# Altium project PCB_Project.PrjPcb
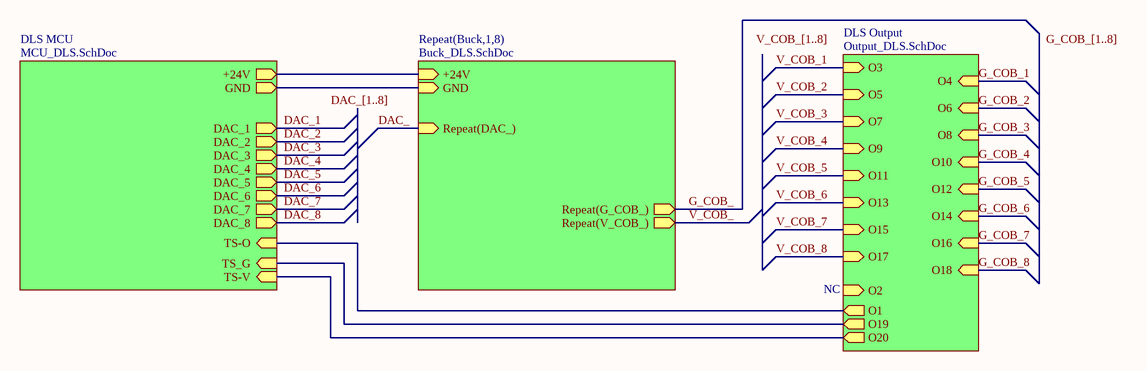
[diagram p0: Main_DLS.SchDoc]
4 sheets, 164 parts. Net scope: hierarchical (ports join the sheet entries above them; power ports are global).
Board file: MainPCB.PcbDoc
Sheets:
  Main_DLS.SchDoc
    DLS MCU = MCU_DLS.SchDoc
    Buck1 = Buck_DLS.SchDoc
    Buck2 = Buck_DLS.SchDoc
    Buck3 = Buck_DLS.SchDoc
    Buck4 = Buck_DLS.SchDoc
    Buck5 = Buck_DLS.SchDoc
    Buck6 = Buck_DLS.SchDoc
    Buck7 = Buck_DLS.SchDoc
    Buck8 = Buck_DLS.SchDoc
    DLS Output = Output_DLS.SchDoc

## Sheet Main_DLS.SchDoc: DLS Main Board
size 254 x 177 mm; Author: hdiushdaisd; DrawnBy: Artur Bereit; Revision: 1.1; SheetNumber: 1; SheetTotal: 4; SPICEModelCacheWKBDPPFP: <root> / <DocumentId>WKBDPPFP</DocumentId> / </root>

### Sub-sheets
DLS MCU = MCU_DLS.SchDoc: DAC_1 (out), DAC_2 (out), DAC_3 (out), DAC_4 (out), DAC_5 (out), DAC_6 (out), DAC_7 (out), DAC_8 (out), TS-O (in), TS_G (in), TS-V (in), +24V (out), GND (out)
DLS Output = Output_DLS.SchDoc: O1 (out), O2 (in), O3 (in), O4 (in), O5 (in), O6 (in), O7 (in), O8 (in), O9 (in), O10 (in), O11 (in), O12 (in), O13 (in), O14 (in), O15 (in), O16 (in), O17 (in), O18 (in), O19 (out), O20 (out)
Repeat(Buck,1,8) = Buck_DLS.SchDoc: Repeat(DAC_) (in), Repeat(G_COB_) (out), Repeat(V_COB_) (out), GND (in), +24V (in)

### Nets
+3.3V: sheet DLS MCU/TS-V, sheet DLS Output/O20
GND: sheet DLS MCU/TS_G, sheet DLS MCU/GND, sheet Repeat(Buck,1,8)/GND, sheet DLS Output/O19
V_COB_1: sheet DLS MCU/+24V, sheet Repeat(Buck,1,8)/+24V, sheet DLS Output/O3, sheet DLS Output/O5, sheet DLS Output/O7, sheet DLS Output/O9, sheet DLS Output/O11, sheet DLS Output/O13, sheet DLS Output/O15, sheet DLS Output/O17  [also labelled V_COB_2, V_COB_3, V_COB_4, V_COB_5, V_COB_6, V_COB_7, V_COB_8]
DAC_: sheet Repeat(Buck,1,8)/Repeat(DAC_)
G_COB_: sheet Repeat(Buck,1,8)/Repeat(G_COB_)
IO1: sheet DLS MCU/TS-O, sheet DLS Output/O1
V_COB_: sheet Repeat(Buck,1,8)/Repeat(V_COB_)

### Buses and harness runs
bus DAC_[1..8]
bus G_COB_[1..8]
bus V_COB_[1..8]

### Notes on the sheet
- NC
- Labels drawn without touching a wire or pin: DAC_[1..8], G_COB_[1..8], V_COB_[1..8]

## Sheet MCU_DLS.SchDoc: DLS MCU
size A3; DrawnBy: Artur Bereit; Revision: 1.0; SheetNumber: 3; SheetTotal: 4; SPICEModelCacheRWZWSWZR: <root> / <DocumentId>RWZWSWZR</DocumentId> / <CacheFrame Number="0"> / <Model Name="0805_150080gs75000" Kind="CKT"> / <Text>****** / .subckt 0805_150080GS75000  1  2 / D1 1 2 SMCW / .MODEL SMCW D / + IS=906.98E-12 / + N=4.4982 / + RS=1.5743 / + IKF=518.93E-9 / + CJO=1.0000E-12 / + M=.3333 / + VJ=.75 / + BV=5 / + IBV=10.00E-6 / + TT=5.0000E-9 / .ends</Text> / </Model> / <Model Name="0805_150080as75000" Kind="CKT"> / <Text>****** / .subckt 0805_150080AS75000  1  2 / D1 1 2 SMCW / .MODEL SMCW D / + IS=10.010E-21 / + N=1.8643 / + RS=1.0000E-6 / + IKF=999 / + CJO=1.0000E-12 / + M=.3333 / + VJ=.75 / + BV=5 / + IBV=10.00E-6 / + TT=5.0000E-9 / .ends</Text> / </Model> / <Model Name="860020672011_22uf" Kind="CKT"> / <Text>******* / .subckt 860020672011_22uF 1 2 / Rser 1 3 0.725557254649 / Lser 2 4 4.139560626E-09 / C1 3 4 0.000022 / Rpar 3 4 4545454.54545455 / .ends 860020672011_22uF</Text> / </Model> / </CacheFrame> / </root>
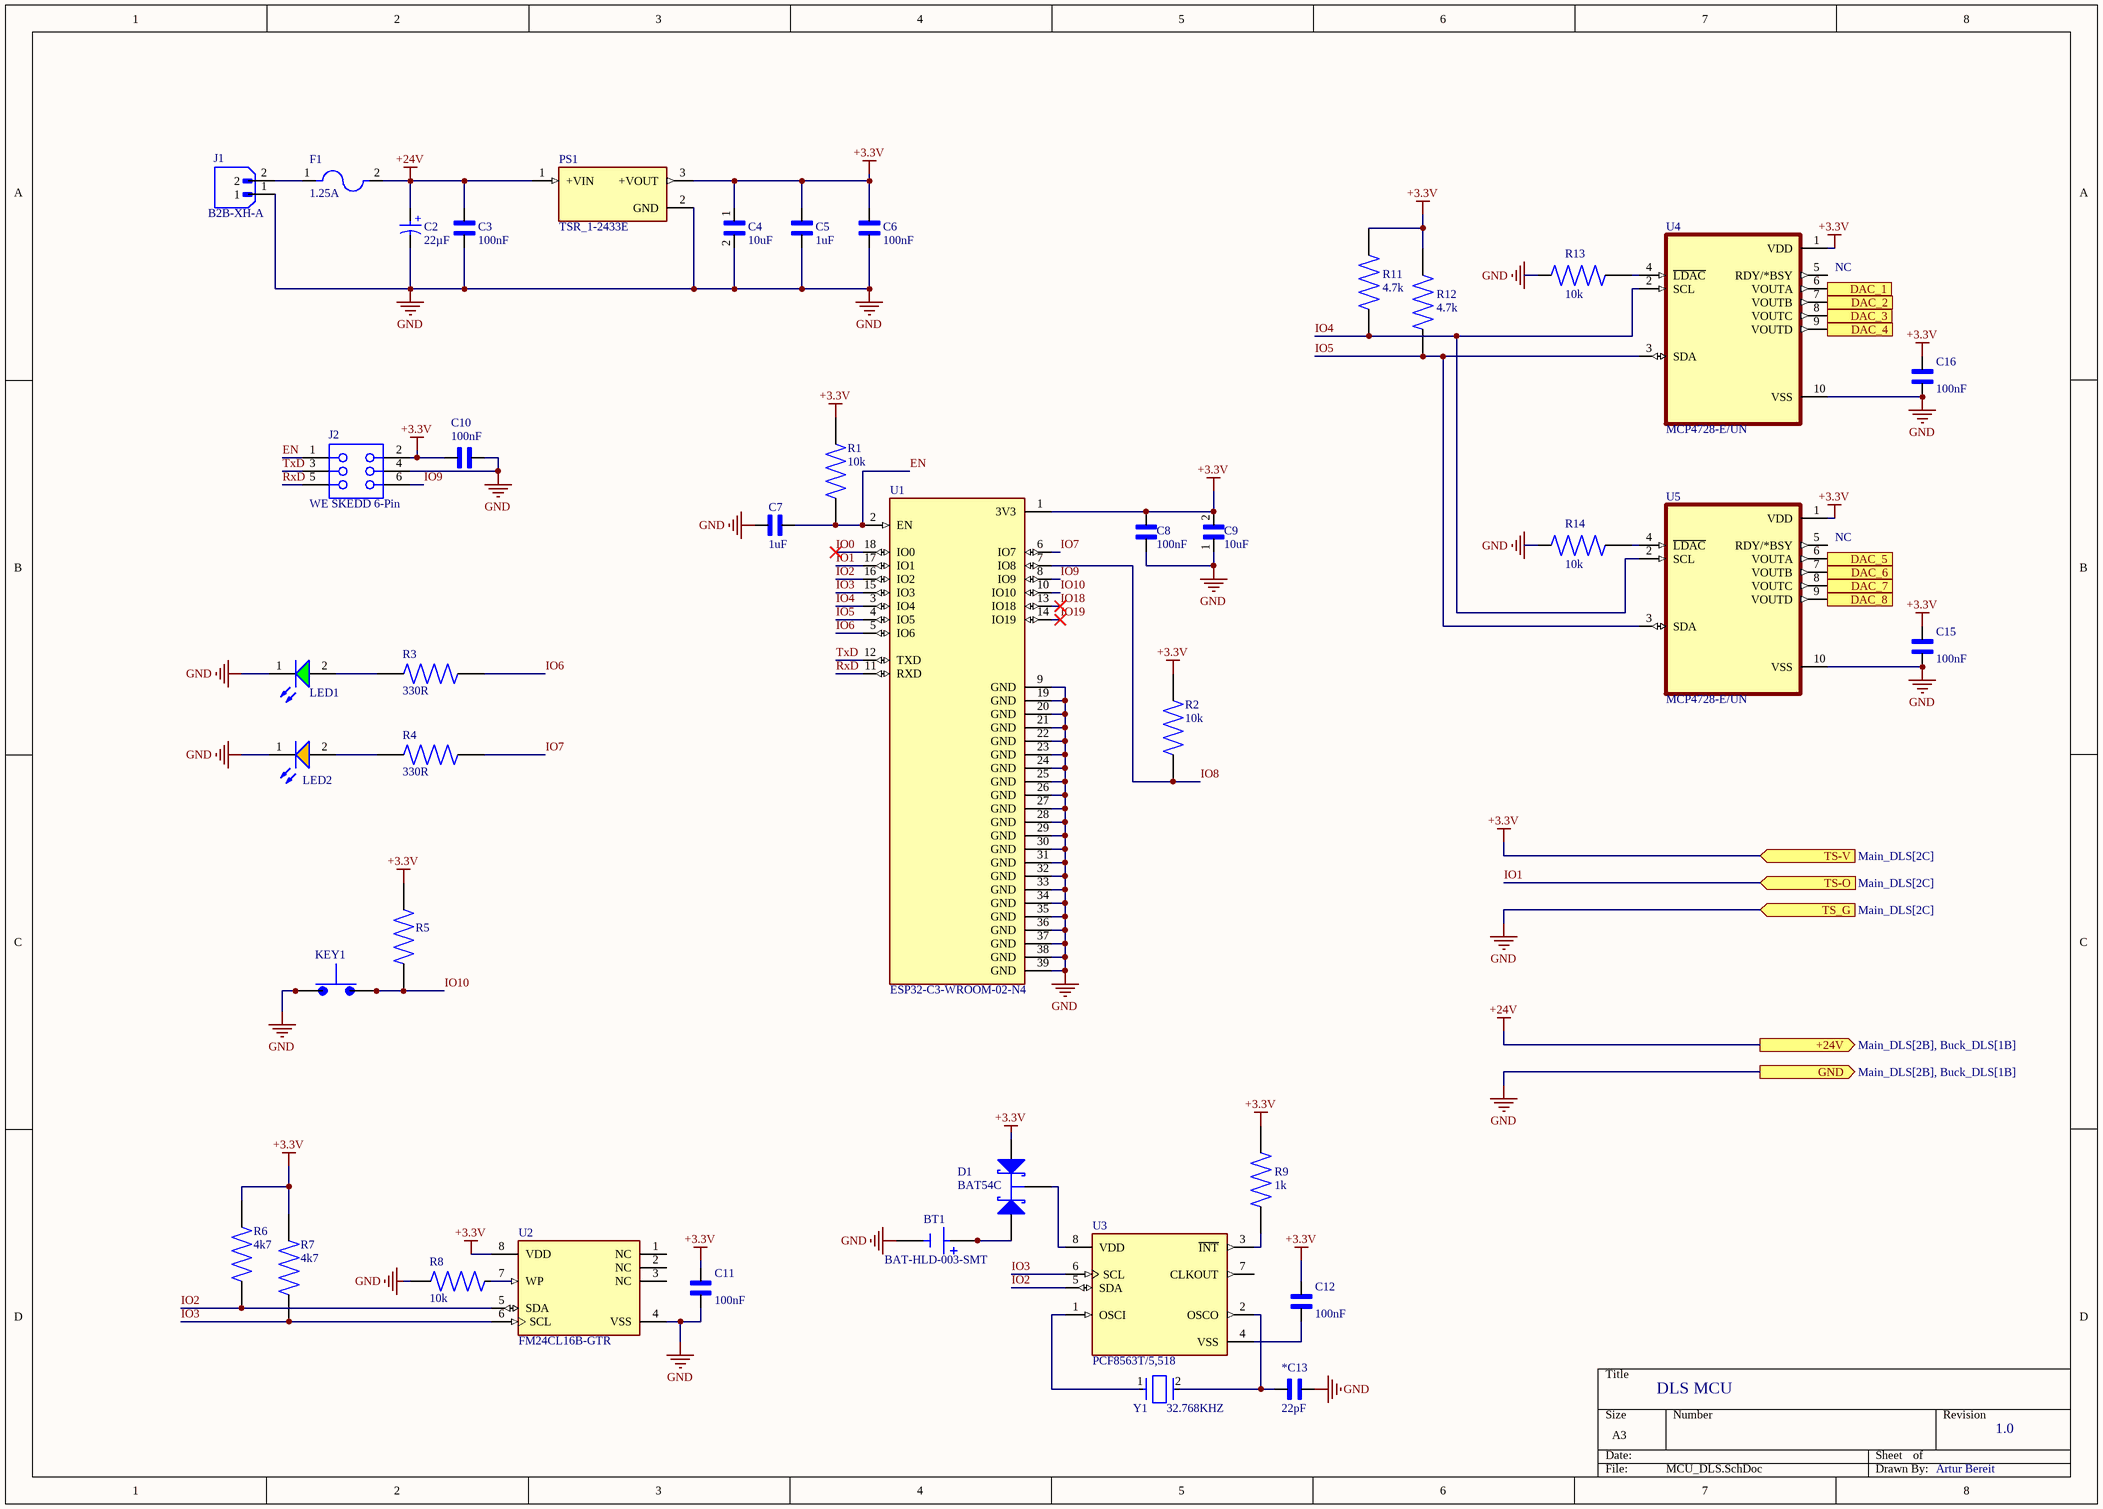
[diagram p1: MCU_DLS.SchDoc]

### Parts
*C13  22pF  [CAPC2012X94N]
BT1  BAT-HLD-003-SMT  [BAT_BAT-HLD-003-SMT]
C2  22µF  [WCAP-ATG5_D5H11]
C3  100nF  [CAPC2012X94N]
C4  10uF  [CAPC2012X145N]
C5  1uF  [CAPC2012X140N]
C6  100nF  [CAPC2012X94N]
C7  1uF  [CAPC2012X140N]
C8  100nF  [CAPC2012X94N]
C9  10uF  [CAPC2012X145N]
C10  100nF  [CAPC2012X94N]
C11  100nF  [CAPC2012X94N]
C12  100nF  [CAPC2012X94N]
C15  100nF  [CAPC2012X94N]
C16  100nF  [CAPC2012X94N]
D1  BAT54C  [NXP-SOT23-3_V]
F1  1.25A  [FUSC6125X279N]
J1  B2B-XH-A  [JST_B2B-XH-A_(LF)(SN)]
J2  WE SKEDD 6-Pin  [490107670612_Permanent Application]
KEY1  SKRPABE010  [SW_SKRPABE010]  (value not drawn)
LED1  Green  [WL-SMCW_0805_150080xx75000]  (value not drawn)
LED2  Amber, 2V, 140°  [WL-SMCW_0805_150080xx75000]  (value not drawn)
PS1  TSR_1-2433E  [CONV_TSR_1-2433E]
R1  10k  [RES_ERJ6ENF1002V]
R2  10k  [RES_ERJ6ENF1002V]
R3  330R  [RES_ERJ6ENF1002V]
R4  330R  [RES_ERJ6ENF1002V]
R5  ERJ6ENF1002V  [RES_ERJ6ENF1002V]  (value not drawn)
R6  4k7  [RES_ERJ6ENF1002V]
R7  4k7  [RES_ERJ6ENF1002V]
R8  10k  [RES_ERJ6ENF1002V]
R9  1k  [RES_ERJ6ENF1002V]
R11  4.7k  [RES_ERJ6ENF1002V]
R12  4.7k  [RES_ERJ6ENF1002V]
R13  10k  [RES_ERJ6ENF1002V]
R14  10k  [RES_ERJ6ENF1002V]
U1  ESP32-C3-WROOM-02-N4  [MODULE_ESP32-C3-WROOM-02-H4]
U2  FM24CL16B-GTR  [FP-51-85066-MFG]
U3  PCF8563T/5,518  [FP-SOT96-1-MFG]
U4  MCP4728-E/UN  [SOP50P490X110-10N]
U5  MCP4728-E/UN  [SOP50P490X110-10N]
Y1  32.768KHZ  [FP-ABS07-MFG]

### Ports
+24V (out, see Main_DLS[2B], Buck_DLS[1B]), DAC_1 (out, see Main_DLS[2B]), DAC_2 (out, see Main_DLS[2B]), DAC_3 (out, see Main_DLS[2B]), DAC_4 (out, see Main_DLS[2B]), DAC_5 (out, see Main_DLS[2B]), DAC_6 (out, see Main_DLS[2B]), DAC_7 (out, see Main_DLS[2C]), DAC_8 (out, see Main_DLS[2C]), GND (out, see Main_DLS[2B], Buck_DLS[1B]), TS-O (in, see Main_DLS[2C]), TS-V (in, see Main_DLS[2C]), TS_G (in, see Main_DLS[2C])

### Nets
+3.3V: C4.1 C5.2 C6.1 C8.2 C9.2 C10.1 C11.2 C12.2 C15.2 C16.2 D1.1(A) J2.2 PS1.3(+VOUT) R1.2 R2.2 R5.2 R6.1 R7.2 R9.2 R11.1 R12.1 U1.1(3V3) U2.8(VDD) U4.1(VDD) U5.1(VDD) ; port TS-V
+24V: C2.1(P) C3.2 F1.2 PS1.1(+VIN) ; port +24V  [project net V_COB_1]
GND: *C13.1 BT1.N(NEG) C2.2(N) C3.1 C4.2 C5.1 C6.2 C7.1 C8.1 C9.1 C10.2 C11.1 C15.1 C16.1 J1.1 J2.4 KEY1.1 KEY1.2 LED1.1(K) LED2.1(K) PS1.2(GND) R8.1 R13.2 R14.2 U1.9(GND) U1.19(GND) U1.20(GND) U1.21(GND) U1.22(GND) U1.23(GND) U1.24(GND) U1.25(GND) U1.26(GND) U1.27(GND) U1.28(GND) U1.29(GND) U1.30(GND) U1.31(GND) U1.32(GND) U1.33(GND) U1.34(GND) U1.35(GND) U1.36(GND) U1.37(GND) U1.38(GND) U1.39(GND) U2.4(VSS) U4.10(VSS) U5.10(VSS) ; port TS_G, port GND
DAC_1: U4.6(VOUTA) ; port DAC_1
DAC_2: U4.7(VOUTB) ; port DAC_2
DAC_3: U4.8(VOUTC) ; port DAC_3
DAC_4: U4.9(VOUTD) ; port DAC_4
DAC_5: U5.6(VOUTA) ; port DAC_5
DAC_6: U5.7(VOUTB) ; port DAC_6
DAC_7: U5.8(VOUTC) ; port DAC_7
DAC_8: U5.9(VOUTD) ; port DAC_8
EN: C7.2 J2.1 R1.1 U1.2(EN)
IO0: U1.18(IO0)
IO1: U1.17(IO1) ; port TS-O
IO2: R6.2 U1.16(IO2) U2.5(SDA) U3.5(SDA)
IO3: R7.1 U1.15(IO3) U2.6(SCL) U3.6(SCL)
IO4: R11.2 U1.3(IO4) U4.2(SCL) U5.2(SCL)
IO5: R12.2 U1.4(IO5) U4.3(SDA) U5.3(SDA)
IO6: R3.2 U1.5(IO6)
IO7: R4.2 U1.6(IO7)
IO8: R2.1 U1.7(IO8)
IO9: J2.6 U1.8(IO9)
IO10: KEY1.3 KEY1.4 R5.1 U1.10(IO10)
IO18: U1.13(IO18)
IO19: U1.14(IO19)
RxD: J2.5 U1.11(RXD)
TxD: J2.3 U1.12(TXD)
Net*C13_2: *C13.2 U3.2(OSCO) Y1.2
NetBT1_P1: BT1.P1(POS) BT1.P2(POS) D1.2(A)
NetC12_1: C12.1 U3.4(VSS)
NetD1_3: D1.3(K) U3.8(VDD)
NetF1_1: F1.1 J1.2
NetLED1_2: LED1.2(A) R3.1
NetLED2_2: LED2.2(A) R4.1
NetR8_2: R8.2 U2.7(WP)
NetR9_1: R9.1 U3.3(~{INT})
NetR13_1: R13.1 U4.4(~{LDAC})
NetR14_1: R14.1 U5.4(~{LDAC})
NetU3_1: U3.1(OSCI) Y1.1

Not connected (* = marked no-connect by the designer): U2 1(NC) 2(NC) 3(NC); U3 7(CLKOUT); U4 5(RDY/*BSY); U5 5(RDY/*BSY)

### Notes on the sheet
- (near U4) NC
- (near U5) NC
- (in symbol 860020672011) +

### Library data of the parts
*C13 C3 C6 C8 C10-C12 C15 C16 = 08055C104KAT2A: Capacitor;Ceramic;0.1uF;10%;50V;Tape/Reel | AVX 08055C104KAT2A; SnapEDA_Link: https://www.snapeda.com/parts/08055C104KAT2A/AVX/view-part/?ref=snap; Package: 2012 AVX; Value: *; MF: AVX; MP: 08055C104KAT2A; Check_prices: https://www.snapeda.com/parts/08055C104KAT2A/AVX/view-part/?ref=eda
BT1 = BAT-HLD-003-SMT: Battery Holder Coin 20 SMT Nickel; MF: Linx Technologies Inc.; SnapEDA_Link: https://www.snapeda.com/parts/BAT-HLD-003-SMT/Linx/view-part/?ref=snap; Package: None; Value: *; MP: BAT-HLD-003-SMT; Check_prices: https://www.snapeda.com/parts/BAT-HLD-003-SMT/Linx/view-part/?ref=eda
C2 = 860020672011: WCAP-ATG5 Aluminum Electrolytic Capacitor, Radial, THT, D5 x H11mm, 22µF, 50V; Manufacturer: Wurth Elektronik; Capacitance Tolerance: +/-20%; Dissipation Factor: 10%; Endurance: 2000h; Leakage Current: 11µA; Ripple Current: 60mA; Technical Reference: ATDC110220M050DSPA3B000; Manufacturer Part Number: 860020672011; Category: Aluminum Electrolytic Capacitors; Match Code: WCAP-ATG5; ComponentLink1Description: Website Link; ComponentLink1URL: https://www.we-online.com/redexpert/article/860020672011?ad; ComponentLink2Description: Datasheet Link; ComponentLink2URL: https://www.we-online.com/redexpert/spec/860020672011?ad; Mount: Through Hole; Operating Temperature Max: 105°C; Operating Temperature Min: -40°C; Packaging: Ammo Pack; Height: 11mm; Diameter: 5mm; Capacitance: 22µF; Rated Voltage (DC): 50V
C4 = GCG21BR70J106KE01L: Package: None; Price: None; Value: *; MP: GCG21BR70J106KE01L; Availability: Unavailable
C5 C7 = GCM21BR71C105KA58L: SMD capacitor X7R(EIA) with capacitance 1.0uF Tol.10%. Rated voltage 16Vdc 125C; MF: Murata; SnapEDA_Link: https://www.snapeda.com/parts/GCM21BR71C105KA58L/Murata/view-part/?ref=snap; Package: 2012-2 Murata; Value: *; MP: GCM21BR71C105KA58L; Check_prices: https://www.snapeda.com/parts/GCM21BR71C105KA58L/Murata/view-part/?ref=eda
C9 = GRJ21BR61E106KE01K: Package: None; Price: None; Value: *; MP: GRJ21BR61E106KE01K; Availability: Unavailable
D1 = CMP-0417-00003-1: Schottky Barrier Diode, 30 V, 2 uA, -55 to 150 degC, 3-Pin SOT23, RoHS, Tape and Reel; Manufacturer: NXP Semiconductors; IR (uA): 2; VF (mV): 800; Trr (ns): 5; Cd (pF): 10; VR (V): 30; Rth(j-a) (K/W): 500; RoHS: TRUE; Packing: Tape and Reel; ComponentLink2URL: http://www.nxp.com/documents/data_sheet/BAT54_SER.pdf; PartNumber: BAT54C; ComponentLink2Description: Datasheet; Temperature Range: -55 to 150 degC; PackageReference: SOT23-3; PackageDescription: 3-Pin Plastic Surface-mounted Package, Body 1.3 x 2.9 mm, Pitch 0.95 mm; Mounting Technology: Surface Mount; ComponentLink1URL: http://www.nxp.com/; DatasheetVersion: Rev. 5; ComponentLink1Description: Manufacturer URL
F1 = 0679L1250-01: 2410 SMT Fuse | Quick Acting | 250mA | Higher AC Voltage; Package: None; Price: None; Value: *; MP: 0679L1250-01; Availability: Unavailable
J1 = B2B-XH-A_(LF)(SN): Connector Header Through Hole 2 position 0.098 (2.50mm); MF: JST Sales; MP: B2B-XH-A (LF)(SN); SnapEDA_Link: https://www.snapeda.com/parts/B2B-XH-A%20(LF)(SN)/JST+Sales+America+Inc./view-part/?ref=snap; Package: None; Value: *; Check_prices: https://www.snapeda.com/parts/B2B-XH-A%20(LF)(SN)/JST+Sales+America+Inc./view-part/?ref=eda
J2 = CMP-1502-02449-2: 490107670612; NexarPartId: 87855882; Contact Resistance: 10mΩ; Gender: Receptacle; Current Rating: 1A; Operating Supply Voltage: 500V; Number of Pins: 6; Lead Pitch: 2.54mm; RoHS: Non-Compliant
KEY1 = SKRPABE010: Switch Tactile N.O. SPST Button J-Bend 0.05A 16VDC 1.57N SMD Automotive T/R; MF: ALPS; SnapEDA_Link: https://www.snapeda.com/parts/SKRPABE010/ALPS/view-part/?ref=snap; Package: None; Value: *; MP: SKRPABE010; Check_prices: https://www.snapeda.com/parts/SKRPABE010/ALPS/view-part/?ref=eda
LED1 = 150080GS75000: WL-SMCW Mono-color Chip LED Waterclear, SMT, size 0805, Green, 3.2V, 140°; Manufacturer: Wurth Elektronik; Case/Size Code: 0805; Chip Technology: InGaN; Dominant Wavelength: 525nm; Luminous Intensity: 450mcd; Peak Wavelength: 515nm; Manufacturer Part Number: 150080GS75000; Category: Signal LEDs; Match Code: WL-SMCW; ComponentLink1Description: Website Link; ComponentLink1URL: https://www.we-online.com/redexpert/article/150080GS75000?ad; ComponentLink2Description: Datasheet Link; ComponentLink2URL: https://www.we-online.com/redexpert/spec/150080GS75000?ad; Mount: Surface Mount; Operating Temperature Max: 85°C; Operating Temperature Min: -40°C; Packaging: Tape and Reel; Length: 2mm; Width: 1.25mm; Height: 0.7mm; Emitting Color: Green; Forward Voltage: 3.2V; Viewing Angle: 140°
LED2 = 150080AS75000: WL-SMCW Mono-color Chip LED Waterclear, SMT, size 0805, Amber, 2V, 140°; Manufacturer: Wurth Elektronik; Case/Size Code: 0805; Chip Technology: AlInGaP; Dominant Wavelength: 605nm; Luminous Intensity: 130mcd; Peak Wavelength: 610nm; Manufacturer Part Number: 150080AS75000; Category: Signal LEDs; Match Code: WL-SMCW; ComponentLink1Description: Website Link; ComponentLink1URL: https://www.we-online.com/redexpert/article/150080AS75000?ad; ComponentLink2Description: Datasheet Link; ComponentLink2URL: https://www.we-online.com/redexpert/spec/150080AS75000?ad; Mount: Surface Mount; Operating Temperature Max: 85°C; Operating Temperature Min: -40°C; Packaging: Tape and Reel; Length: 2mm; Width: 1.25mm; Height: 0.7mm; Emitting Color: Amber; Forward Voltage: 2V; Viewing Angle: 140°
PS1 = TSR_1-2433E: 1 Amp POL converter, industrial, wide input range, pos.-pos. circuit, cost efficient, LM78 compatible, SIP-3; MF: Traco Power; MP: TSR 1-2433E; SnapEDA_Link: https://www.snapeda.com/parts/TSR%201-2433E/Traco+Power/view-part/?ref=snap; Package: NON STANDARD-3 Traco Power; Value: *; Check_prices: https://www.snapeda.com/parts/TSR%201-2433E/Traco+Power/view-part/?ref=eda
R1 R2 R5-R8 R11-R14 = ERJ6ENF1002V: 10 kOhms Â±1% 0.125W, 1/8W Chip Resistor 0805 (2012 Metric) Automotive AEC-Q200 Thick Film; MF: Panasonic; Check_prices: https://www.snapeda.com/parts/ERJ6ENF1002V/Panasonic/view-part/5776803/?ref=eda; SnapEDA_Link: https://www.snapeda.com/parts/ERJ6ENF1002V/Panasonic/view-part/5776803/?ref=snap; Value: *; Digi-Key_Part_Number: P10.0KCCT-ND; MP: ERJ6ENF1002V; Package: 2012-2 Panasonic
R3 = ERJ6ENF1002V: 330Ohms Â±1% 0.125W, 1/8W Chip Resistor 0805 (2012 Metric) Automotive AEC-Q200 Thick Film; MF: Panasonic; Check_prices: https://www.snapeda.com/parts/ERJ6ENF1002V/Panasonic/view-part/5776803/?ref=eda; SnapEDA_Link: https://www.snapeda.com/parts/ERJ6ENF1002V/Panasonic/view-part/5776803/?ref=snap; Value: *; Digi-Key_Part_Number: P10.0KCCT-ND; MP: ERJ6ENF1002V; Package: 2012-2 Panasonic
R4 = ERJ6ENF1002V: 330R Â±1% 0.125W, 1/8W Chip Resistor 0805 (2012 Metric) Automotive AEC-Q200 Thick Film; MF: Panasonic; Check_prices: https://www.snapeda.com/parts/ERJ6ENF1002V/Panasonic/view-part/5776803/?ref=eda; SnapEDA_Link: https://www.snapeda.com/parts/ERJ6ENF1002V/Panasonic/view-part/5776803/?ref=snap; Value: *; Digi-Key_Part_Number: P10.0KCCT-ND; MP: ERJ6ENF1002V; Package: 2012-2 Panasonic
R9 = ERJ6ENF1002V: 1 kOhms Â±1% 0.125W, 1/8W Chip Resistor 0805 (2012 Metric) Automotive AEC-Q200 Thick Film; MF: Panasonic; Check_prices: https://www.snapeda.com/parts/ERJ6ENF1002V/Panasonic/view-part/5776803/?ref=eda; SnapEDA_Link: https://www.snapeda.com/parts/ERJ6ENF1002V/Panasonic/view-part/5776803/?ref=snap; Value: *; Digi-Key_Part_Number: P10.0KCCT-ND; MP: ERJ6ENF1002V; Package: 2012-2 Panasonic
U1 = ESP32-C3-WROOM-02-N4: WiFi Modules (802.11) (Engineering Samples) SMD module, ESP32-C3, 4MB SPI flash, PCB antenna, -40 C +85 C; MF: Espressif Systems; Value: *; SnapEDA_Link: https://www.snapeda.com/parts/ESP32-C3-WROOM-02-N4/Espressif+Systems/view-part/?ref=snap; Purchase-URL: https://pricing.snapeda.com/search/part/ESP32-C3-WROOM-02-N4/?ref=eda; Availability: In Stock; Price: None; Package: Package; Check_prices: https://www.snapeda.com/parts/ESP32-C3-WROOM-02-N4/Espressif+Systems/view-part/?ref=eda; MP: ESP32-C3-WROOM-02-N4
U2 = CMP-12945-000019-1: IC FRAM 16K I2C 1MHZ 8SOIC; Data Bus Width: 8b; Memory Type: RAM; Memory Size: 16KB; Max Supply Voltage: 3.65V; Operating Supply Voltage: 3V; Nominal Supply Current: 300uA; Access Time: 550ns; Min Supply Voltage: 2.7V; Package Quantity: 2500; Max Operating Temperature: 85°C; Interface: I2C; Contact Plating: Tin; Lead Free: Lead Free; Mount: Surface Mount; Word Size: 8b; Number of Pins: 8; Frequency: 1MHz; Density: 16Kb; Case/Package: SOIC; Packaging: Tape and Reel; Min Operating Temperature: -40°C
U3 = CMP-10083-000010-1: IC RTC CLK/CALENDAR I2C 8-SOIC; Manufacturer: NXP; Nominal Supply Current: 0.225-0.95uA; Interface: I2C,2-Wire; Min Supply Voltage: 1V; Frequency: 400kHz; Standoff Height: 0.1mm; Number Of Outputs: 1; Max Supply Voltage: 5.5V; Digikey Description: IC RTC CLK/CALENDAR I2C 8-SOIC; Height: 1.75mm; Temperature: -40°C to +85°C; Category: IC; Package: SOT96-1; Ambient Temperature Range High: +85°C; Octopart: https://octopart.com/pcf8563t%2F5%2C518-nxp+semiconductors-19647995; Footprint Url: https://www.nxp.com/docs/en/package-information/SOT96-1.pdf; ComponentLink2URL: https://www.nxp.com/docs/en/data-sheet/PCF8563.pdf; RoHS: TRUE; ComponentLink2Description: Datasheet; Lead Free: Yes; Temperature Range Low: -40°C; Ambient Temperature Range Low: -40°C; Manufacturer Part Number: PCF8563T/5,518; Device Class L3: Real Time Clocks; Temperature Range High: +85°C; Automotive: No; Device Class L2: Clock and Timing; Mouser Description: Real Time Clock Binary I2C 1-5V RTC IC; Device Class L1: Integrated Circuits (ICs)
U4 U5 = MCP4728-E/UN: Microchip 4-channel 12 bit Serial DAC 10-Pin MSOP | Microchip Technology Inc. MCP4728-E/UN; SnapEDA_Link: https://www.snapeda.com/parts/MCP4728-E/UN/Microchip/view-part/?ref=snap; Package: MSOP-10 Microchip; Value: *; MF: Microchip; MP: MCP4728-E/UN; Check_prices: https://www.snapeda.com/parts/MCP4728-E/UN/Microchip/view-part/?ref=eda
Y1 = CMP-27762-014373-1: Crystal 32.768kHz ±20ppm (Tol) 7pF FUND 70kΩ 2-Pin CSMD T/R; Insulation Resistance: 500MR; Series Resistance: 70kR; Mount: Surface Mount; Tolerance: 20ppm; Length: 3.2mm; Lead Free: Lead Free; Frequency: 32.768kHz; Frequency Tolerance: 20ppm; Frequency Stability: 20ppm; Load Capacitance: 7pF; Radiation Hardening: No; Package Quantity: 3000; Width: 1.5mm; Height: 0.9mm; Termination: SMD/SMT; Max Operating Temperature: 85°C; Number of Pins: 2; Operating Frequency: 32.768 kHz; ESR (Equivalent Series Resistance): 70kR; Packaging: Tape and Reel; Series: ABS07; Min Operating Temperature: -40°C; Depth: 1.5mm; Case/Package: CSMD

## Sheet Buck_DLS.SchDoc
size A4; SheetNumber: 4; SheetTotal: 4; CHANNEL: 0..7; Repeat: True
Used 8 times, as channels Buck1, Buck2, Buck3, Buck4, Buck5, Buck6, Buck7, Buck8. Parts and nets are listed once, with the designators drawn on the sheet.
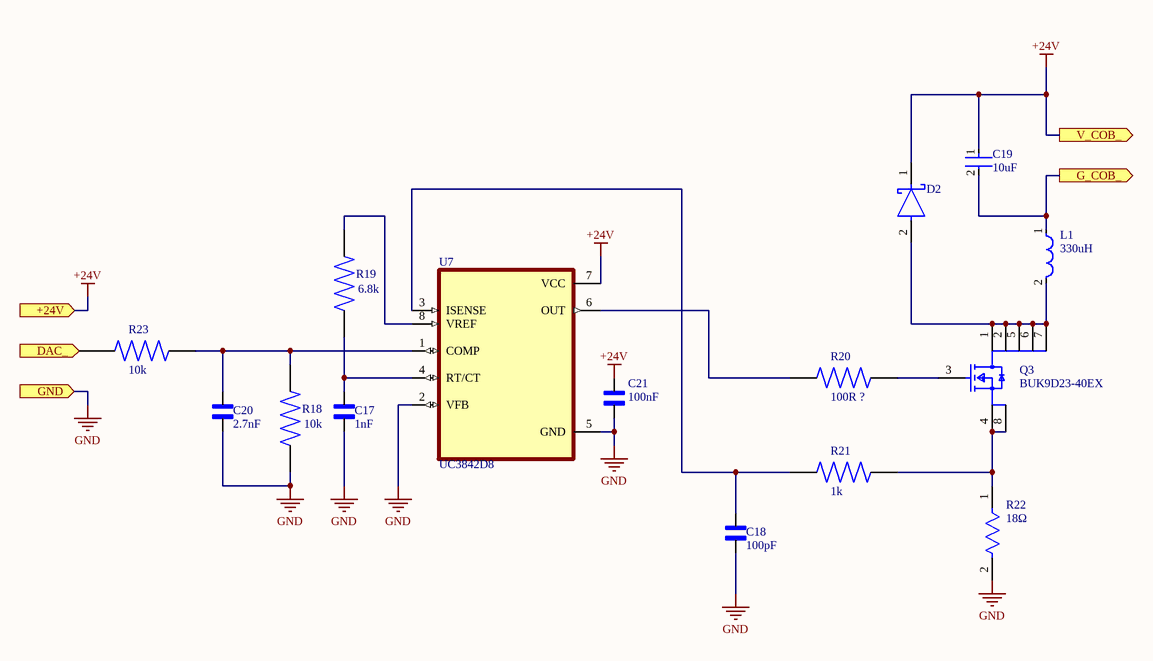
[diagram p2: Buck_DLS.SchDoc]

### Parts
C17  1nF  [CAPC2012X94N]
C18  100pF  [CAPC2012X94N]
C19  10uF  [FP-GRT319-0_15-IPC_C]
C20  2.7nF  [CAPC2012X94N]
C21  100nF  [CAPC2012X94N]
D2  (no value)  [FP-SOD123W-MFG]
L1  330uH  [FP-SRR1260-MFG]
Q3  BUK9D23-40EX  [FP-SOT1220-MFG]
R18  10k  [RES_ERJ6ENF1002V]
R19  6.8k  [RES_ERJ6ENF1002V]
R20  100R ?  [RES_ERJ6ENF1002V]
R21  1k  [RES_ERJ6ENF1002V]
R22  18Ω  [FP-CRGP1206-IPC_C]
R23  10k  [RES_ERJ6ENF1002V]
U7  UC3842D8  [SOIC127P599X175-8N]

### Ports
+24V (in, see Main_DLS[3B], MCU_DLS[7C]), DAC_ (in, see Main_DLS[3B]), G_COB_ (out, see Main_DLS[4C]), GND (in, see Main_DLS[3B], MCU_DLS[7C]), V_COB_ (out, see Main_DLS[4C])

### Nets
+24V: C19.1 C21.2 D2.1(C) U7.7(VCC) ; port V_COB_, port +24V
GND: C17.1 C18.1 C20.1 C21.1 R18.1 R22.2 U7.2(VFB) U7.5(GND) ; port GND
DAC_: R23.1 ; port DAC_
G_COB_: C19.2 L1.1 ; port G_COB_
NetC17_2: C17.2 R19.1 U7.4(RT/CT)
NetC18_2: C18.2 R21.1 U7.3(ISENSE)
NetC20_2: C20.2 R18.2 R23.2 U7.1(COMP)
NetD2_2: D2.2(A) L1.2 Q3.1(D) Q3.2(D) Q3.5(D) Q3.6(D) Q3.7(D)
NetQ3_3: Q3.3(G) R20.2
NetQ3_4: Q3.4(S) Q3.8(S) R21.2 R22.1
NetR19_2: R19.2 U7.8(VREF)
NetR20_1: R20.1 U7.6(OUT)

### Channels
Buck1: designators end in _Buck1; ports +24V=V_COB_1 DAC_=DAC_1 G_COB_=G_COB_1 GND=GND V_COB_=V_COB_1
Buck2: designators end in _Buck2; ports +24V=V_COB_1 DAC_=DAC_2 G_COB_=G_COB_2 GND=GND V_COB_=V_COB_1
Buck3: designators end in _Buck3; ports +24V=V_COB_1 DAC_=DAC_3 G_COB_=G_COB_3 GND=GND V_COB_=V_COB_1
Buck4: designators end in _Buck4; ports +24V=V_COB_1 DAC_=DAC_4 G_COB_=G_COB_4 GND=GND V_COB_=V_COB_1
Buck5: designators end in _Buck5; ports +24V=V_COB_1 DAC_=DAC_5 G_COB_=G_COB_5 GND=GND V_COB_=V_COB_1
Buck6: designators end in _Buck6; ports +24V=V_COB_1 DAC_=DAC_6 G_COB_=G_COB_6 GND=GND V_COB_=V_COB_1
Buck7: designators end in _Buck7; ports +24V=V_COB_1 DAC_=DAC_7 G_COB_=G_COB_7 GND=GND V_COB_=V_COB_1
Buck8: designators end in _Buck8; ports +24V=V_COB_1 DAC_=DAC_8 G_COB_=G_COB_8 GND=GND V_COB_=V_COB_1

### Library data of the parts
C17 C18 C20 C21 = 08055C104KAT2A: as *C13 on sheet MCU_DLS; SnapEDA_Link: https://www.snapeda.com/parts/08055C104KAT2A/AVX/view-part/?ref=snap; Package: 2012 AVX; Value: *; MF: AVX; MP: 08055C104KAT2A; Check_prices: https://www.snapeda.com/parts/08055C104KAT2A/AVX/view-part/?ref=eda
C19 = CMP-06035-050745-1: Multi-Layer Ceramic Capacitor 10uF 35V X5R ±10% 1206 Paper T/R - GRT319R6YA106KE01J
D2 = CMP-14398-000026-1: DIODE SCHOTTKY 40V 3A SOD123W, PMEG4030ER,115; RoHS Compliant: Yes
L1 = CMP-2000-07146-2: FIXED IND 15UH 5A 27 MOHM SMD; Q Factor: 25; Sample Rate (Hz): 100kHz; Resistance: 27MR; Material: Steel; Inductance Tolerance: 20%; Frequency: 17.6MHz; Saturation Current: 4.6A; Core Material: Ferrite; Shielding: Shielded; Series: SRR1260; Termination: SMD/SMT; Packaging: Tape and Reel; RoHS Compliant: Yes; Height - Seated (Max): 0.256inch; Depth: 12.8mm; Case/Package: 1260; Inductance: 15uH; Height: 6mm; Number of Pins: 2; Mount: Surface Mount; Min Operating Temperature: -40°C; Test Frequency: 100kHz; Length: 12.5mm; Self Resonant Frequency: 17.6MHz; Current Rating: 5A; Tolerance: 20%; RMS Current (Irms): 5A; REACH SVHC: No SVHC; Resistor Type: Wirewound; DC Resistance (DCR): 27mR; Width: 12.5mm; Package Quantity: 600; DC Current: 5A; Max DC Current: 5A; Max Operating Temperature: 125°C; Military Standard: Not
Q3 = CMP-14409-000007-1: MOSFET N-CH 40V 8A 6DFN2020MD; Manufacturer: Nexperia; Rthja Max: 57K/W; Gate Charge At Vgs: 11.5nC @ 10V; Reverse Recovery Charge: 5.3nC; Turn On Delay Time: 2ns; Number Of N Channels: 1; Drain To Source Resistance: 18mΩ; Reverse Recovery Time: 12.9ns; Transconductance: 39S; Automotive Grade: Grade 0; Turn Off Delay Time: 12ns; Typ Forward Diode Voltage: 0.8V; Max Junction Temp: +175°C; Max Forward Diode Voltage: 1.2V; Gate To Source Voltage: 15V; Input Capacitace At Vds: 637pF @ 20V; Power Dissipation: 2.3W; Threshold Vgs Max: 2.1V; Depletion Mode: False; Threshold Vgs Min: 1.4V; Pulse Drain Current: 76A; Drain To Source Breakdown Voltage: 40V; RoHS: TRUE; Ambient Temperature Range Low: -55°C; Height: 0.65mm; Drain To Source Voltage: 40V; Temperature: -55°C to +175°C; Number Of Channels: 1; Automotive: Yes; Footprint Url: https://assets.nexperia.com/documents/outline-drawing/SOT1220.pdf; Digikey Description: MOSFET N-CH 40V 8A 6DFN2020MD; Device Class L1: Discrete Semiconductors; Manufacturer Part Number: BUK9D23-40EX; Package: SOT1220; ComponentLink2URL: https://assets.nexperia.com/documents/data-sheet/BUK9D23-40E.pdf; Category: Trans; Lead Free: Yes; Continuous Drain Current: 8A; Temperature Range Low: -55°C; Temperature Range High: +175°C; Device Class L2: Transistors; Device Class L3: MOSFETs; Octopart: https://octopart.com/buk9d23-40ex-nexperia-87872643; ComponentLink2Description: Datasheet; Ambient Temperature Range High: +175°C
R18-R20 R23 = ERJ6ENF1002V: as R1 on sheet MCU_DLS; Check_prices: https://www.snapeda.com/parts/ERJ6ENF1002V/Panasonic/view-part/5776803/?ref=eda; SnapEDA_Link: https://www.snapeda.com/parts/ERJ6ENF1002V/Panasonic/view-part/5776803/?ref=snap; Value: *; Digi-Key_Part_Number: P10.0KCCT-ND; MP: ERJ6ENF1002V; Package: 2012-2 Panasonic
R21 = ERJ6ENF1002V: 1kOhm Â±1% 0.125W, 1/8W Chip Resistor 0805 (2012 Metric); MF: Panasonic; Check_prices: https://www.snapeda.com/parts/ERJ6ENF1002V/Panasonic/view-part/5776803/?ref=eda; SnapEDA_Link: https://www.snapeda.com/parts/ERJ6ENF1002V/Panasonic/view-part/5776803/?ref=snap; Value: *; Digi-Key_Part_Number: P10.0KCCT-ND; MP: ERJ6ENF1002V; Package: 2012-2 Panasonic
R22 = CMP-03211-005493-1: CRGP1206F18R - CRGP1206 18Ω 0.5W ±100ppm/°C 1% 200V; Manufacturer: TE; Tolerance: 0.01; ComponentLink2Description: Datasheet; Ipc Land Pattern Name: RESC310155X55; RoHS: TRUE; Power Rating: 0.5W; Value: 18Ω; Octopart: https://octopart.com/crgp1206f18r-te+connectivity-91018856; Resistance: 18Ω; Device Class L3: Chip SMD Resistors; Temperature Range Low: -55°C; Voltage Rating: 200V; Series: CRGP; Ambient Temperature Range High: +70°C; Category: Res; Package: CRGP1206; ComponentLink2URL: https://www.mouser.com/datasheet/2/418/NG_DS_9-1773463-9_A-1358566.pdf; Device Class L2: Resistors; Device Class L1: Passive Components; Manufacturer Part Number: CRGP1206F18R; Height: 0.65mm; Temperature Coefficient: ±100ppm/°C; Temperature: -55°C to +155°C; Automotive: No; Lead Free: Yes; Temperature Range High: +155°C; Composition: Thick Film
U7 = UC3842D8: Single ended 500KHz current mode PWM controller with 16V/10V UVLO 100% duty cycle, 0C to 70C; MF: Texas Instruments; SnapEDA_Link: https://www.snapeda.com/parts/UC3842D8/Texas+Instruments/view-part/?ref=snap; Package: SOIC-8 Texas Instruments; Value: *; MP: UC3842D8; Check_prices: https://www.snapeda.com/parts/UC3842D8/Texas+Instruments/view-part/?ref=eda

## Sheet Output_DLS.SchDoc
size 127 x 127 mm; SheetNumber: 2; SheetTotal: 4
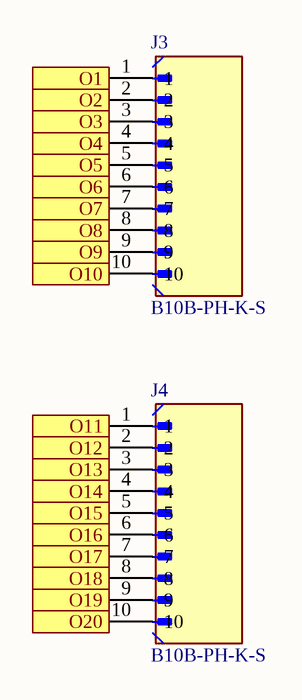
[diagram p3: Output_DLS.SchDoc]

### Parts
J3  B10B-PH-K-S  [JST_B10B-PH-K-S]
J4  B10B-PH-K-S  [JST_B10B-PH-K-S]

### Ports
O1 (in, see Main_DLS[5C]), O2 (in, see Main_DLS[5C]), O3 (in, see Main_DLS[5B]), O4 (in, see Main_DLS[5B]), O5 (in, see Main_DLS[5B]), O6 (in, see Main_DLS[5B]), O7 (in, see Main_DLS[5B]), O8 (in, see Main_DLS[5B]), O9 (in, see Main_DLS[5B]), O10 (in, see Main_DLS[5B]), O11 (in, see Main_DLS[5B]), O12 (in, see Main_DLS[5B]), O13 (in, see Main_DLS[5C]), O14 (in, see Main_DLS[5C]), O15 (in, see Main_DLS[5C]), O16 (in, see Main_DLS[5C]), O17 (in, see Main_DLS[5C]), O18 (out, see Main_DLS[5C]), O19 (out, see Main_DLS[5C]), O20 (out, see Main_DLS[5C])

### Nets
+3.3V: J4.10 ; port O20
GND: J4.9 ; port O19
V_COB_1: J3.3 J3.5 J3.7 J3.9 J4.1 J4.3 J4.5 J4.7 ; port O3, port O5, port O7, port O9, port O11, port O13, port O15, port O17
G_COB_1: J3.4 ; port O4
G_COB_2: J3.6 ; port O6
G_COB_3: J3.8 ; port O8
G_COB_4: J3.10 ; port O10
G_COB_5: J4.2 ; port O12
G_COB_6: J4.4 ; port O14
G_COB_7: J4.6 ; port O16
G_COB_8: J4.8 ; port O18
IO1: J3.1 ; port O1
NetJ3_2: J3.2 ; port O2

### Library data of the parts
J3 J4 = B10B-PH-K-S: 2.0 mm pitch/Disconnectable Crimp style connectors; MF: JST Sales America Inc.; SnapEDA_Link: https://www.snapeda.com/parts/B10B-PH-K-S/JST/view-part/?ref=snap; Package: None; Value: *; MP: B10B-PH-K-S; Check_prices: https://www.snapeda.com/parts/B10B-PH-K-S/JST/view-part/?ref=eda

## Nets that join several sheets
+3.3V: MCU_DLS (25 pins), Output_DLS (J4.10)
GND: MCU_DLS (49 pins), Buck1 (8 pins), Buck2 (8 pins), Buck3 (8 pins), Buck4 (8 pins), Buck5 (8 pins), Buck6 (8 pins), Buck7 (8 pins), Buck8 (8 pins), Output_DLS (J4.9)
V_COB_1: MCU_DLS (C2.1 C3.2 F1.2 PS1.1), Buck1 (C19_Buck1.1 C21_Buck1.2 D2_Buck1.1 U7_Buck1.7), Buck2 (C19_Buck2.1 C21_Buck2.2 D2_Buck2.1 U7_Buck2.7), Buck3 (C19_Buck3.1 C21_Buck3.2 D2_Buck3.1 U7_Buck3.7), Buck4 (C19_Buck4.1 C21_Buck4.2 D2_Buck4.1 U7_Buck4.7), Buck5 (C19_Buck5.1 C21_Buck5.2 D2_Buck5.1 U7_Buck5.7), Buck6 (C19_Buck6.1 C21_Buck6.2 D2_Buck6.1 U7_Buck6.7), Buck7 (C19_Buck7.1 C21_Buck7.2 D2_Buck7.1 U7_Buck7.7), Buck8 (C19_Buck8.1 C21_Buck8.2 D2_Buck8.1 U7_Buck8.7), Output_DLS (8 pins)
DAC_1: MCU_DLS (U4.6), Buck1 (R23_Buck1.1)
DAC_2: MCU_DLS (U4.7), Buck2 (R23_Buck2.1)
DAC_3: MCU_DLS (U4.8), Buck3 (R23_Buck3.1)
DAC_4: MCU_DLS (U4.9), Buck4 (R23_Buck4.1)
DAC_5: MCU_DLS (U5.6), Buck5 (R23_Buck5.1)
DAC_6: MCU_DLS (U5.7), Buck6 (R23_Buck6.1)
DAC_7: MCU_DLS (U5.8), Buck7 (R23_Buck7.1)
DAC_8: MCU_DLS (U5.9), Buck8 (R23_Buck8.1)
G_COB_1: Buck1 (C19_Buck1.2 L1_Buck1.1), Output_DLS (J3.4)
G_COB_2: Buck2 (C19_Buck2.2 L1_Buck2.1), Output_DLS (J3.6)
G_COB_3: Buck3 (C19_Buck3.2 L1_Buck3.1), Output_DLS (J3.8)
G_COB_4: Buck4 (C19_Buck4.2 L1_Buck4.1), Output_DLS (J3.10)
G_COB_5: Buck5 (C19_Buck5.2 L1_Buck5.1), Output_DLS (J4.2)
G_COB_6: Buck6 (C19_Buck6.2 L1_Buck6.1), Output_DLS (J4.4)
G_COB_7: Buck7 (C19_Buck7.2 L1_Buck7.1), Output_DLS (J4.6)
G_COB_8: Buck8 (C19_Buck8.2 L1_Buck8.1), Output_DLS (J4.8)
IO1: MCU_DLS (U1.17), Output_DLS (J3.1)